# Altium schematic sheet STM32_microcontroller_IOs.SchDoc: STM32 microcontroller I/Os
size A4; Author: Ph.A; SheetNumber: 3; SheetTotal: 8
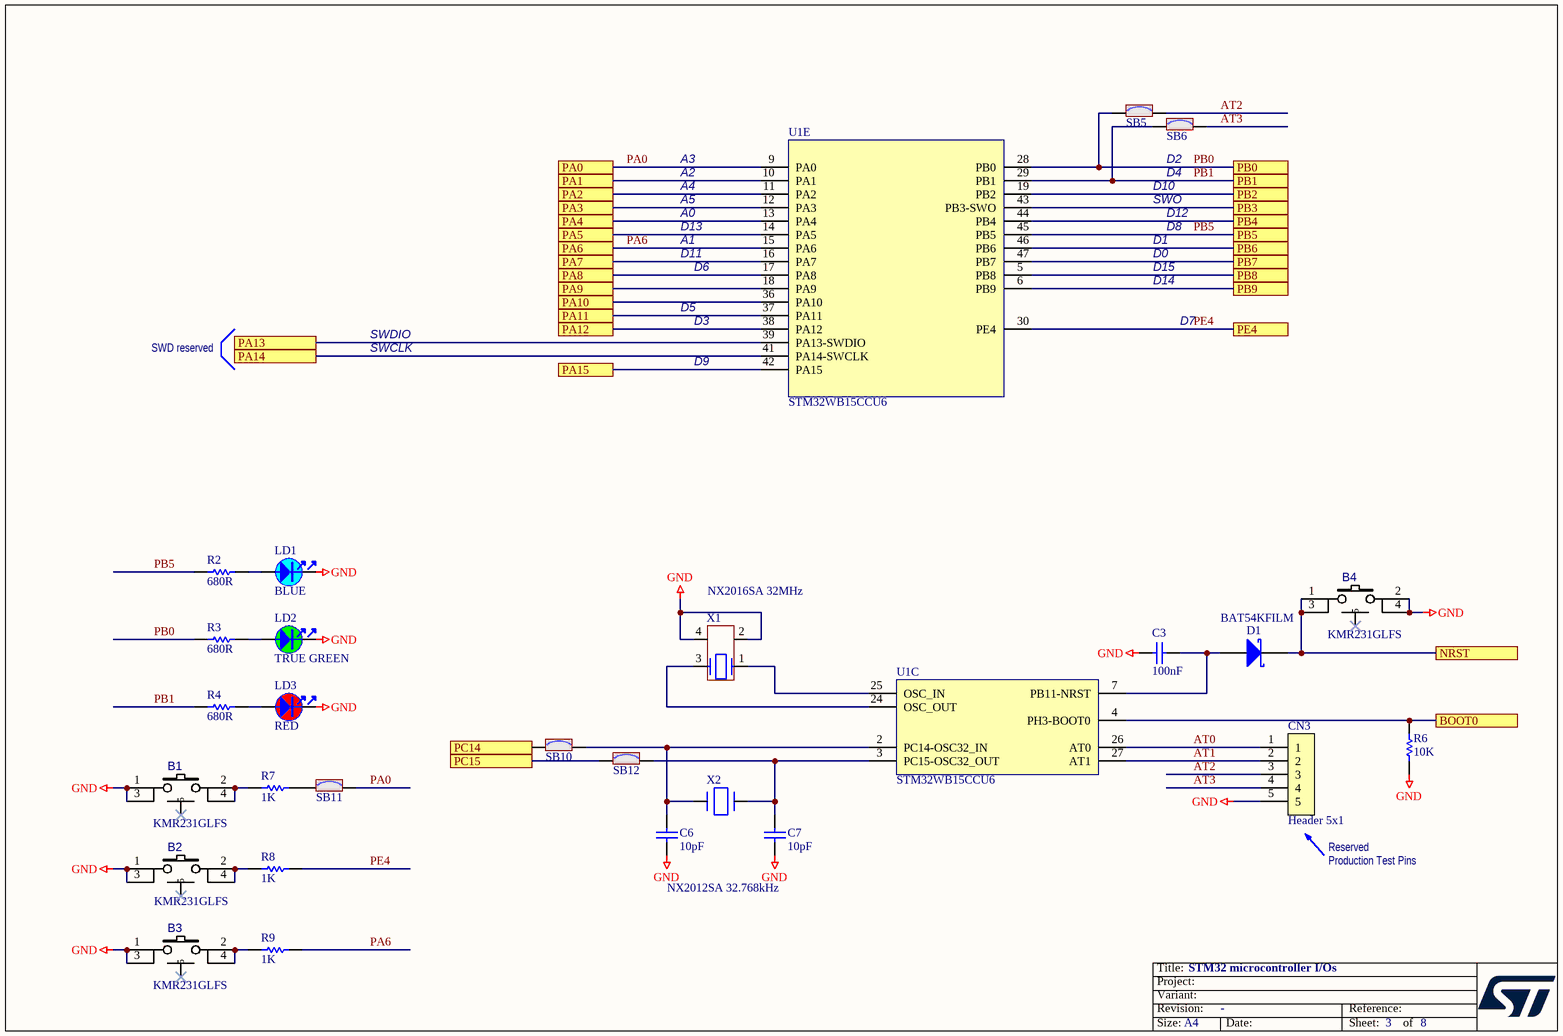
[diagram p0: STM32_microcontroller_IOs.SchDoc]

## Parts
B1  value KMR231GLFS  [SWI_C&K_Y78B23110FP__ITT_KMR231GLFS]  (hidden comment: SW-PUSH-CMS_KMR2_BLACK)
B2  value KMR231GLFS  [SWI_C&K_Y78B23110FP__ITT_KMR231GLFS]  (hidden comment: SW-PUSH-CMS_KMR2_BLACK)
B3  value KMR231GLFS  [SWI_C&K_Y78B23110FP__ITT_KMR231GLFS]  (hidden comment: SW-PUSH-CMS_KMR2_BLACK)
B4  value KMR231GLFS  [SWI_C&K_Y78B23110FP__ITT_KMR231GLFS]  (hidden comment: SW-PUSH-CMS_KMR2_BLACK)
C3  value 100nF  [C0402]  (hidden comment: Capacitor)
C6  value 10pF  [C0402]  (hidden comment: Capacitor)
C7  value 10pF  [C0402]  (hidden comment: Capacitor)
CN3  Header 5x1  [CON_SAMTEC_TSW-105-07-X-S]
D1  value BAT54KFILM  [DIO_SOD523_1A_2K]  (hidden comment: SCHOTTKY_1A_2K)
LD1  value BLUE  [LED_0603_VISHAY_VLMB1300-GS08_BLUE_1A2K_H0P8]  (hidden comment: LED_blue)
LD2  value TRUE GREEN  [LED_0603_VISHAY_VLMTG1300-GS08_GREEN_1A2K_H0P8]  (hidden comment: LED_green)
LD3  value RED  [LED_0603_VISHAY_VLMS1300-GS08_RED_1A2K_H0P8]  (hidden comment: LED_red)
R2  value 680R  [R0402]  (hidden comment: Resistor)
R3  value 680R  [R0402]  (hidden comment: Resistor)
R4  value 680R  [R0402]  (hidden comment: Resistor)
R6  value 10K  [R0402]  (hidden comment: Resistor)
R7  value 1K  [R0402]  (hidden comment: Resistor)
R8  value 1K  [R0402]  (hidden comment: Resistor)
R9  value 1K  [R0402]  (hidden comment: Resistor)
SB5  SB_ON  [SOLDER-BRIDGE_R0402-0R]  (value not drawn)
SB6  SB_ON  [SOLDER-BRIDGE_R0402-0R]  (value not drawn)
SB10  SB_ON  [SOLDER-BRIDGE_R0402-0R]  (value not drawn)
SB11  SB_ON  [SOLDER-BRIDGE_R0402-0R]  (value not drawn)
SB12  SB_ON  [SOLDER-BRIDGE_R0402-0R]  (value not drawn)
U1  value STM32WB15CCU6  [ICC_UFQFPN48-EPAD_7X7_H0P55_P050]  (hidden comment: STM32WB15_QFN48)  (parts C,E of 5)
X1  value NX2016SA 32MHz  [CRY_NX2016SA_4P]  (hidden comment: XTAL_4_PINS)
X2  value NX2012SA 32.768kHz  [CRY_NX2012SA_2P]  (hidden comment: XTAL_2_PINS)

## Ports
BOOT0, NRST, PA0, PA1, PA2, PA3, PA4, PA5, PA6, PA7, PA8, PA9, PA10, PA11, PA12, PA13, PA14, PA15, PB0, PB1, PB2, PB3, PB4, PB5, PB6, PB7, PB8, PB9, PC14, PC15, PE4

## Nets
GND: B1.1 B1.3 B2.1 B2.3 B3.1 B3.3 B4.2 B4.4 C3.1 C6.1 C7.1 CN3.5 LD1.2 LD2.2 LD3.2 R6.1 X1.2 X1.4
AT0: CN3.1 U1.26(AT0)
AT1: CN3.2 U1.27(AT1)
AT2: CN3.3 SB5.2
AT3: CN3.4 SB6.2
BOOT0: R6.2 U1.4(PH3-BOOT0) ; port BOOT0
NRST: B4.1 B4.3 D1.2(K) ; port NRST
PA0: SB11.2 U1.9(PA0) ; port PA0
PA1: U1.10(PA1) ; port PA1
PA2: U1.11(PA2) ; port PA2
PA3: U1.12(PA3) ; port PA3
PA4: U1.13(PA4) ; port PA4
PA5: U1.14(PA5) ; port PA5
PA6: R9.2 U1.15(PA6) ; port PA6
PA7: U1.16(PA7) ; port PA7
PA8: U1.17(PA8) ; port PA8
PA9: U1.18(PA9) ; port PA9
PA10: U1.36(PA10) ; port PA10
PA11: U1.37(PA11) ; port PA11
PA12: U1.38(PA12) ; port PA12
PA13: U1.39(PA13-SWDIO) ; port PA13
PA14: U1.41(PA14-SWCLK) ; port PA14
PA15: U1.42(PA15) ; port PA15
PB0: R3.1 SB5.1 U1.28(PB0) ; port PB0
PB1: R4.1 SB6.1 U1.29(PB1) ; port PB1
PB2: U1.19(PB2) ; port PB2
PB3: U1.43(PB3-SWO) ; port PB3
PB4: U1.44(PB4) ; port PB4
PB5: R2.1 U1.45(PB5) ; port PB5
PB6: U1.46(PB6) ; port PB6
PB7: U1.47(PB7) ; port PB7
PB8: U1.5(PB8) ; port PB8
PB9: U1.6(PB9) ; port PB9
PC14: SB10.1 ; port PC14
PC15: SB12.1 ; port PC15
PE4: R8.2 U1.30(PE4) ; port PE4
NetB1_2: B1.2 B1.4 R7.1
NetB2_2: B2.2 B2.4 R8.1
NetB3_2: B3.2 B3.4 R9.1
NetC3_2: C3.2 D1.1(A) U1.7(PB11-NRST)
NetC6_2: C6.2 SB10.2 U1.2(PC14-OSC32_IN) X2.1(X1)
NetC7_2: C7.2 SB12.2 U1.3(PC15-OSC32_OUT) X2.2(X2)
NetLD1_1: LD1.1 R2.2
NetLD2_1: LD2.1 R3.2
NetLD3_1: LD3.1 R4.2
NetR7_2: R7.2 SB11.1
NetU1_24: U1.24(OSC_OUT) X1.3
NetU1_25: U1.25(OSC_IN) X1.1

Not connected (* = marked no-connect by the designer): B1 5*; B2 5*; B3 5*; B4 5*

## Notes on the sheet
- A2
- A3
- D2
- D4
- D13
- A4
- A5
- A0
- A1
- D1
- SWO
- D10
- D12
- D8
- D5
- D11
- D6
- D0
- D14
- D15
- SWD reserved
- SWDIO
- SWCLK
- D9
- D3
- D7
- Reserved
- Production Test Pins
- Title:
- Project:
- Size:
- Revision:
- Variant:
- -
- Date:
- Reference:
- Sheet:
- of

## Library data of the parts
B1-B4 = MCD-01485: Microminiature Tact Switch for SMT - KMR 2 Series - 1.9 mm height; Part_Type: Misc; Manufacturer: C&K; Part_Preference: Recommended; Internal_Part_Number: MCD-01485; Status: Released; Manufacturer_Part_Number: KMR231GLFS; ComponentLink1URL: http://tunmcdsvn.tun.st.com/Component_Datasheet_Library/Trunk/Misc/C&K_tactile_switch_KMR_series
C3 = MCD-00006: Capacitor, MLCC, 100nF, 16V, X7R, +/-10%, 0402, T=0.5mm; Manufacturer_Part_Number: CC0402KRX7R7BB104; Manufacturer: YAGEO; Alternate_Manufacturer_Part_Number: GCM155R71C104KA55D; Alternate_Manufacturer: MURATA; Part_Preference: Recommended; Order_Code_RS: 616-9701; Internal_Part_Number: MCD-00006; Status: Released; Part_Type: Capacitor; Package: C0402; ComponentLink1URL: http://tunmcdsvn.tun.st.com/Component_Datasheet_Library/Trunk/Capacitors/Yageo_Multilayer_Capacitor_X7R_series_100pF_to_22uF; Order_Code_Digikey: 311-1338-1-ND; Order_Code_Farnell: 9402047
C6 C7 = MCD-00015: Capacitor, MLCC, 10pF, 50V, NPO, +/-5%, 0402, T=0,5mm; Manufacturer_Part_Number: CC0402JRNPO9BN100; Manufacturer: YAGEO; Part_Preference: Recommended; Internal_Part_Number: MCD-00015; Status: Released; Part_Type: Capacitor; Package: C0402; ComponentLink1URL: http://tunmcdsvn.tun.st.com/Component_Datasheet_Library/Trunk/Capacitors/Yageo_Capacitor_NP0_16V-to-50V
CN3 = MCD-02060: Header, 5x1, 2,54mm, VR, TH, Height 5.84mm/2.54mm; Part_Type: Connector; Manufacturer_Part_Number: TSW-105-07-G-S; Manufacturer: SAMTEC; Part_Preference: Recommended; Order_Code_RS: 161-2268; Internal_Part_Number: MCD-02060; Value: Header 5x1; Status: Checked; ComponentLink1URL: http://tunmcdsvn.tun.st.com/Component_Datasheet_Library/Trunk/Connectors/Samtec_TSW-HTSW-series; Alternate_Manufacturer: N/A; Alternate_Manufacturer_Part_Number: N/A; Package: N/A; Order_Code_Digikey: SAM1029-05-ND; Order_Code_Farnell: 2856705
D1 = MCD-01677: Small signal Schottky diodes; Part_Type: Diode; Manufacturer: STMICROELECTRONICS; BMS_Part_Number: 9151123; Part_Preference: Recommended; Manufacturer_HQ_COO: EU; Internal_Part_Number: MCD-01677; Status: Checked; Manufacturer_Part_Number: BAT54KFILM; Package: SOD-523; ComponentLink1URL: http://tunmcdsvn.tun.st.com/Component_Datasheet_Library/Trunk/Diodes/STM_SCHOTTKY_DOUBLE_BAT54SWFILM/STM_SCHOTTKY_DOUBLE_BAT54SWFILM.pdf
LD1 = MCD-00584: LED Blue, 0603 SMD, 3.3 V Forward Voltage; Part_Type: Display; Manufacturer_Part_Number: VLMB1300-GS08; Manufacturer: VISHAY; Part_Preference: Recommended; Order_Code_RS: 7730430; Internal_Part_Number: MCD-00584; Status: Released; Package: LED 0603; ComponentLink1URL: http://tunmcdsvn.tun.st.com/Component_Datasheet_Library/Trunk/Display/VISHAY_LED_BLUE_VLMB1300-GS08; Order_Code_Digikey: VLMB1300-GS08CT-ND; Order_Code_Farnell: 2251459
LD2 = MCD-00589: LED Green, 0603 SMD, Fw Voltage = 2.8V - 3.6V; Part_Type: Display; Manufacturer_Part_Number: VLMTG1300-GS08; Manufacturer: VISHAY; Alternate_Manufacturer_Part_Number: LG Q396-PS-35; Alternate_Manufacturer: OSRAM OPTO SEMICONDUCTORS; Part_Preference: Recommended; Order_Code_RS: 7730452; Internal_Part_Number: MCD-00589; Status: Released; Package: LED 0603; ComponentLink1URL: http://tunmcdsvn.tun.st.com/Component_Datasheet_Library/Trunk/Display/VISHAY_LED_GREEN_VLMTG1300-GS08; Order_Code_Digikey: VLMTG1300-GS08CT-ND; Order_Code_Farnell: 2251490
LD3 = MCD-00587: LED Red, 0603 SMD, 2V Forward Voltage; Part_Type: Display; Manufacturer_Part_Number: VLMS1300-GS08; Manufacturer: VISHAY; Alternate_Manufacturer_Part_Number: LS Q976-NR-1; Alternate_Manufacturer: OSRAM OPTO SEMICONDUCTORS; Part_Preference: Recommended; Internal_Part_Number: MCD-00587; Status: Released; Package: LED 0603; ComponentLink1URL: http://tunmcdsvn.tun.st.com/Component_Datasheet_Library/Trunk/Display/VISHAY_LED_RED_VLMS1300-GS08; Order_Code_Digikey: VLMS1300-GS08CT-ND; Order_Code_Farnell: 2078728
R2-R4 = MCD-00507: Resistor,680R,0402,1%,1/16W; Manufacturer_Part_Number: RC0402FR-07680RL; Manufacturer: YAGEO; Part_Preference: Recommended; Internal_Part_Number: MCD-00507; Status: Released; Part_Type: Resistor; Package: R0402; ComponentLink1URL: http://tunmcdsvn.tun.st.com/Component_Datasheet_Library/Trunk/Resistors/Yageo_Resistor_RC0402-series; Order_Code_Digikey: 311-680LRCT-ND; Order_Code_Farnell: 9239219; Order_Code_RS: N/A
R6 = MCD-00053: Resistor,10K,0402,1%,1/16W; Manufacturer_Part_Number: RC0402FR-0710KL; Manufacturer: YAGEO; BMS_Part_Number: 9131590; Part_Preference: Recommended; Internal_Part_Number: MCD-00053; Status: Released; Part_Type: Resistor; Package: R0402; ComponentLink1URL: http://tunmcdsvn.tun.st.com/Component_Datasheet_Library/Trunk/Resistors/Yageo_Resistor_RC0402-series; Order_Code_Digikey: 311-10.0KLRCT-ND; Order_Code_Farnell: 9239359; Order_Code_RS: N/A
R7-R9 = MCD-00061: Resistor,1K,0402,1%,1/16W; Manufacturer_Part_Number: RC0402FR-071KL; Manufacturer: YAGEO; Part_Preference: Recommended; Internal_Part_Number: MCD-00061; Status: Released; Part_Type: Resistor; Package: R0402; ComponentLink1URL: http://tunmcdsvn.tun.st.com/Component_Datasheet_Library/Trunk/Resistors/Yageo_Resistor_RC0402-series; Order_Code_Digikey: 311-1.00KLRCT-ND; Order_Code_Farnell: 9239235; Order_Code_RS: N/A
SB5 SB6 SB10-SB12 = MCD-01618: Solder Bridge 0402 ON; Part_Type: Misc; Manufacturer_Part_Number: RC0402JR-070RL; Manufacturer: YAGEO; Part_Preference: Recommended; Order_Code_RS: 618-5804; Internal_Part_Number: MCD-01618; Status: Released; Package: SB0402; ComponentLink1URL: http://tunmcdsvn.tun.st.com/Component_Datasheet_Library/Trunk/Resistors/Yageo_Resistor_RC0402-series; Order_Code_Digikey: 311-0.0JRTR-ND; Order_Code_Farnell: 2363467
U1 = MCD-02058: Multiprotocol wireless 32-bit MCU ARM®-based Cortex®-M4 with FPU, Bluetooth® Low-Energy and 802.15.4 radio solution; Part_Type: IC; Manufacturer: STMICROELECTRONICS; Part_Preference: Recommended; Manufacturer_HQ_COO: EU; Component_Country_Of_Origin: China; Internal_Part_Number: MCD-02058; Status: Standby; Manufacturer_Part_Number: STM32WB15CCU6; Package: UFQFPN48; ComponentLink1URL: http://tunmcdsvn.tun.st.com/Component_Datasheet_Library/Trunk/IC/STM_MCU_STM32WB15CCU6; Alternate_Manufacturer: N/A; Alternate_Manufacturer_Part_Number: N/A; Order_Code_Digikey: N/A; Order_Code_Farnell: N/A; Order_Code_RS: N/A
X1 = MCD-01446: Crystal 32MHz, 8pF, +-10ppm, 60ohms max, SMD; Part_Type: Crystal oscillator; Manufacturer_Part_Number: NX2016SA 32MHz EXS00A-CS06654; Manufacturer: NDK; BMS_Part_Number: 9157042; Part_Preference: Recommended; Internal_Part_Number: MCD-01446; Status: Checked; Package: NX2016SA; ComponentLink1URL: http://tunmcdsvn.tun.st.com/Component_Datasheet_Library/Trunk/Crystal_Osc/NDK_NX2016SA 32MHz EXS00A-CS06654 (ESX10B-18811D)/NX2016SA 32MHz EXS00A-CS06654 (ESX10B-18811D).pdf; Order_Code_Digikey: 644-1373; Order_Code_Farnell: N/A; Order_Code_RS: N/A
X2 = MCD-01445: Crystal 32.768kHz, 7pF, +-20ppm, 80Kohms max, SMD; Part_Type: Crystal oscillator; Manufacturer_Part_Number: NX2012SA 32.768kHz EXS00A-MU00389; Manufacturer: NDK; BMS_Part_Number: 9157043; Part_Preference: Recommended; Internal_Part_Number: MCD-01445; Status: Checked; Package: NX2012SA; ComponentLink1URL: http://tunmcdsvn.tun.st.com/Component_Datasheet_Library/Trunk/Crystal_Osc/NDK_NX2012SA 32.768KHz EXS00A-MU00389/NX2012SA 32.768kHz EXS00A-MU00389 (EXS11B-04659).pdf; Order_Code_Digikey: 644-1350